# EAGLE schematic Gira tasterplatine (EAGLE 5.07)
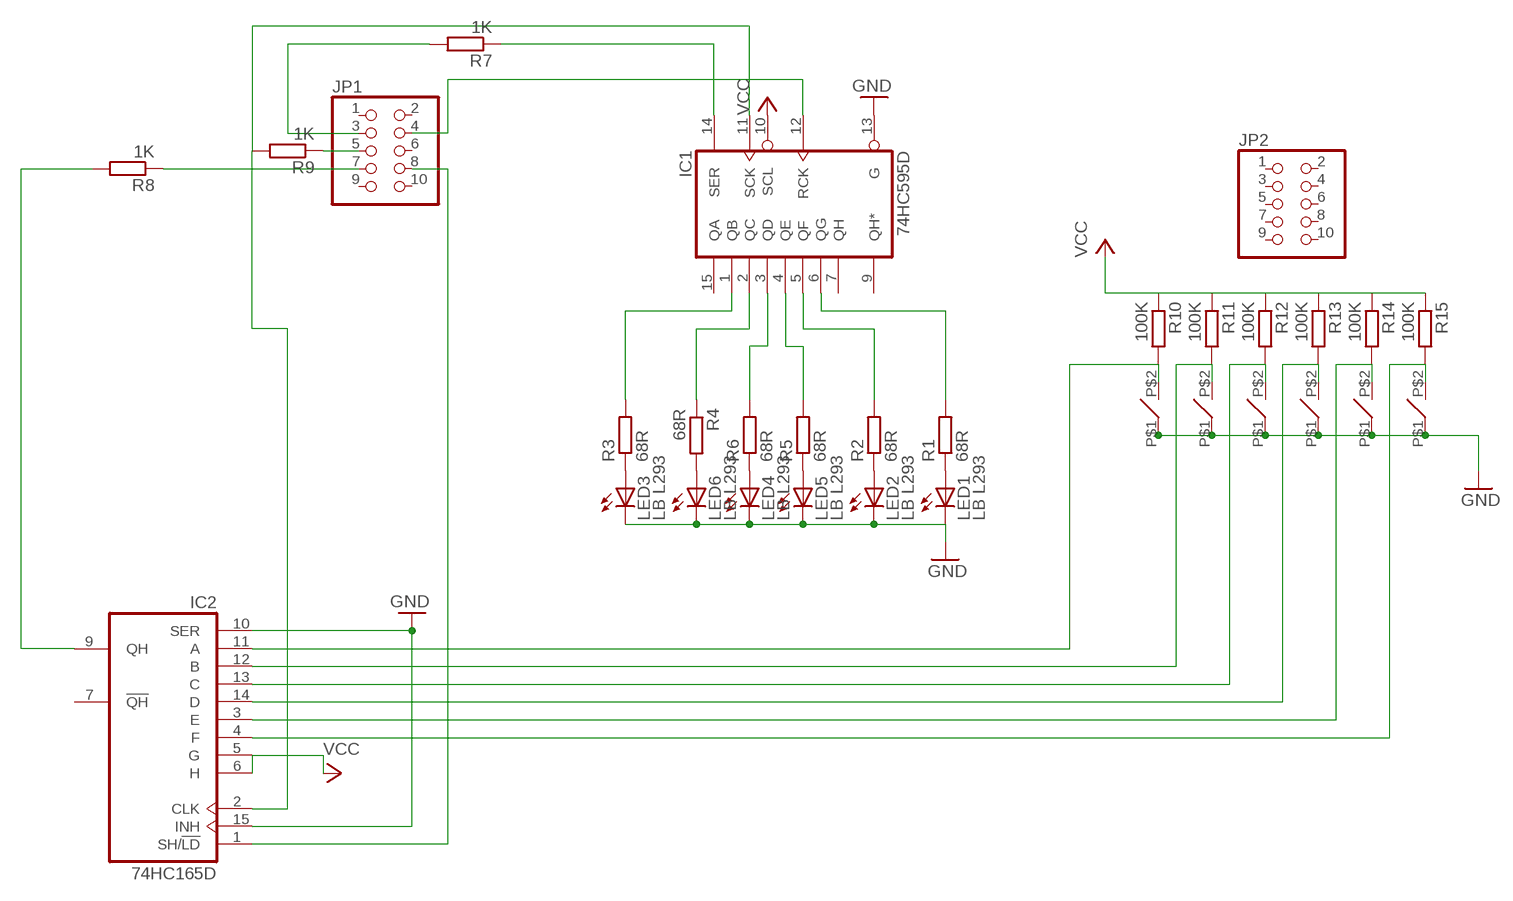
[diagram p0: schematic, sheet 1]

## Parts
IC1  74HC595D  [SO16]
IC2  74HC165D  [SO16]
JP1  PINHD-2X5  [2X05]
JP2  PINHD-2X5  [2X05]
LED1  LB L293  LEDCHIP-LED0603  [CHIP-LED0603]
LED2  LB L293  LEDCHIP-LED0603  [CHIP-LED0603]
LED3  LB L293  LEDCHIP-LED0603  [CHIP-LED0603]
LED4  LB L293  LEDCHIP-LED0603  [CHIP-LED0603]
LED5  LB L293  LEDCHIP-LED0603  [CHIP-LED0603]
LED6  LB L293  LEDCHIP-LED0603  [CHIP-LED0603]
R1  68R  R-EU_R1206  [R1206]
R2  68R  R-EU_R1206  [R1206]
R3  68R  R-EU_R1206  [R1206]
R4  68R  R-EU_R1206  [R1206]
R5  68R  R-EU_R1206  [R1206]
R6  68R  R-EU_R1206  [R1206]
R7  1K  R-EU_R1206  [R1206]
R8  1K  R-EU_R1206  [R1206]
R9  1K  R-EU_R1206  [R1206]
R10  100K  R-EU_R1206  [R1206]
R11  100K  R-EU_R1206  [R1206]
R12  100K  R-EU_R1206  [R1206]
R13  100K  R-EU_R1206  [R1206]
R14  100K  R-EU_R1206  [R1206]
R15  100K  R-EU_R1206  [R1206]
S1  B3U1100PSMD  [B3U1100PSMD]
S2  B3U1100PSMD  [B3U1100PSMD]
S3  B3U1100PSMD  [B3U1100PSMD]
S4  B3U1100PSMD  [B3U1100PSMD]
S5  B3U1100PSMD  [B3U1100PSMD]
S6  B3U1100PSMD  [B3U1100PSMD]

## Nets
CLK: IC2.1(SH/!LD) JP1.8
GND: IC1.13(G) IC2.10(SER) IC2.15(INH) LED1.C LED2.C LED3.C LED4.C LED5.C LED6.C S1.P$1 S2.P$1 S3.P$1 S4.P$1 S5.P$1 S6.P$1
N$1: LED1.A R1.1
N$2: LED2.A R2.1
N$3: LED3.A R3.1
N$4: LED4.A R6.1
N$5: LED5.A R5.1
N$6: LED6.A R4.2
N$7: IC1.6(QG) R1.2
N$8: IC1.5(QF) R2.2
N$9: IC1.4(QE) R5.2
N$10: IC1.3(QD) R6.2
N$11: IC1.2(QC) R4.1
N$12: IC1.1(QB) R3.2
N$13: IC2.11(A) R10.2 S2.P$2
N$14: IC2.12(B) R11.2 S1.P$2
N$15: IC2.13(C) R12.2 S4.P$2
N$16: IC2.14(D) R13.2 S3.P$2
N$17: IC2.3(E) R14.2 S6.P$2
N$18: IC2.4(F) R15.2 S5.P$2
N$21: IC2.9(QH) R8.2
N$23: IC1.12(RCK) JP1.4
N$25: IC1.14(SER) R7.1
N$26: IC1.11(SCK) IC2.2(CLK) R9.2
N$27: JP1.5 R9.1
SERIALIN: JP1.7 R8.1
SERIALOUT: JP1.3 R7.2
VCC: IC1.10(SCL) IC2.5(G) IC2.6(H) R10.1 R11.1 R12.1 R13.1 R14.1 R15.1
Unconnected: IC1.7(QH) IC1.9(QH*) IC1.15(QA) IC2.7(!QH) JP1.1 JP1.2 JP1.6 JP1.9 JP1.10 JP2.1 JP2.2 JP2.3 JP2.4 JP2.5 JP2.6 JP2.7 JP2.8 JP2.9 JP2.10

## Power pins joined to a net without a drawn wire
GND: IC1.8(GND) IC2.8(GND)
VCC: IC1.16(VCC) IC2.16(VCC)

## Library data of the parts
IC1 = 74xx-eu:74*595: 8-bit SHIFT REGISTER, output latch
IC2 = 74xx-eu:74*165: 8-bit parallel load SHIFT REGISTER
JP1 JP2 = pinhead:PINHD-2X5: PIN HEADER
LED1-LED6 = led:LED: LED OSRAM: - CHIPLED LG R971, LG N971, LY N971, LG Q971, LY Q971, LO R971, LY R971 LH N974, LH R974 LS Q976, LO Q976, LY Q976 LO Q996 - Hyper CHIPLED LW Q18S LB Q993, LB Q99A, LB R99A - SideLED LS A670, LO A670, LY A670, LG A670, LP A670 LB A673, LV A673, LT A673, LW A673 LH A674 LY A675 LS A676, LA A676, LO A676, LY A676, LW A676 LS A679, LY A679, LG A679 - Hyper Micro SIDELED® LS Y876, LA Y876, LO Y876, LY Y876 LT Y87S - SmartLED LW L88C, LW L88S LB L89C, LB L89S, LG L890 LS L89K, LO L89K, LY L89K LS L896, LA L896, LO L896, LY L896 - TOPLED LS T670, LO T670, LY T670, LG T670, LP T670 LSG T670, LSP T670, LSY T670, LOP T670, LYG T670 LG T671, LOG T671, LSG T671 LB T673, LV T673, LT T673, LW T673 LH T674 LS T676, LA T676, LO T676, LY T676, LB T676, LH T676, LSB T676, LW T676 LB T67C, LV T67C, LT T67C, LS T67K, LO T67K, LY T67K, LW E67C LS E67B, LA E67B, LO E67B, LY E67B, LB E67C, LV E67C, LT E67C LW T67C LS T679, LY T679, LG T679 LS T770, LO T770, LY T770, LG T770, LP T770 LB T773, LV T773, LT T773, LW T773 LH T774 LS E675, LA E675, LY E675, LS T675 LS T776, LA T776, LO T776, LY T776, LB T776 LHGB T686 LT T68C, LB T68C - Hyper Mini TOPLED® LB M676 - Mini TOPLED Santana® LG M470 LS M47K, LO M47K, LY M47K Source: http://www.osram.convergy.de LUXEON: - LUMILED® LXK2-PW12-R00, LXK2-PW12-S00, LXK2-PW14-U00, LXK2-PW14-V00 LXK2-PM12-R00, LXK2-PM12-S00, LXK2-PM14-U00 LXK2-PE12-Q00, LXK2-PE12-R00, LXK2-PE12-S00, LXK2-PE14-T00, LXK2-PE14-U00 LXK2-PB12-K00, LXK2-PB12-L00, LXK2-PB12-M00, LXK2-PB14-N00, LXK2-PB14-P00, LXK2-PB14-Q00 LXK2-PR12-L00, LXK2-PR12-M00, LXK2-PR14-Q00, LXK2-PR14-R00 LXK2-PD12-Q00, LXK2-PD12-R00, LXK2-PD12-S00 LXK2-PH12-R00, LXK2-PH12-S00 LXK2-PL12-P00, LXK2-PL12-Q00, LXK2-PL12-R00 Source: www.luxeon.com KINGBRIGHT: KA-3528ASYC Source: www.kingbright.com
R1-R15 = rcl:R-EU_: RESISTOR, European symbol
S1-S6 = Switch 6x2:B3U1100P